# Altium project CANwheel.PrjPcb
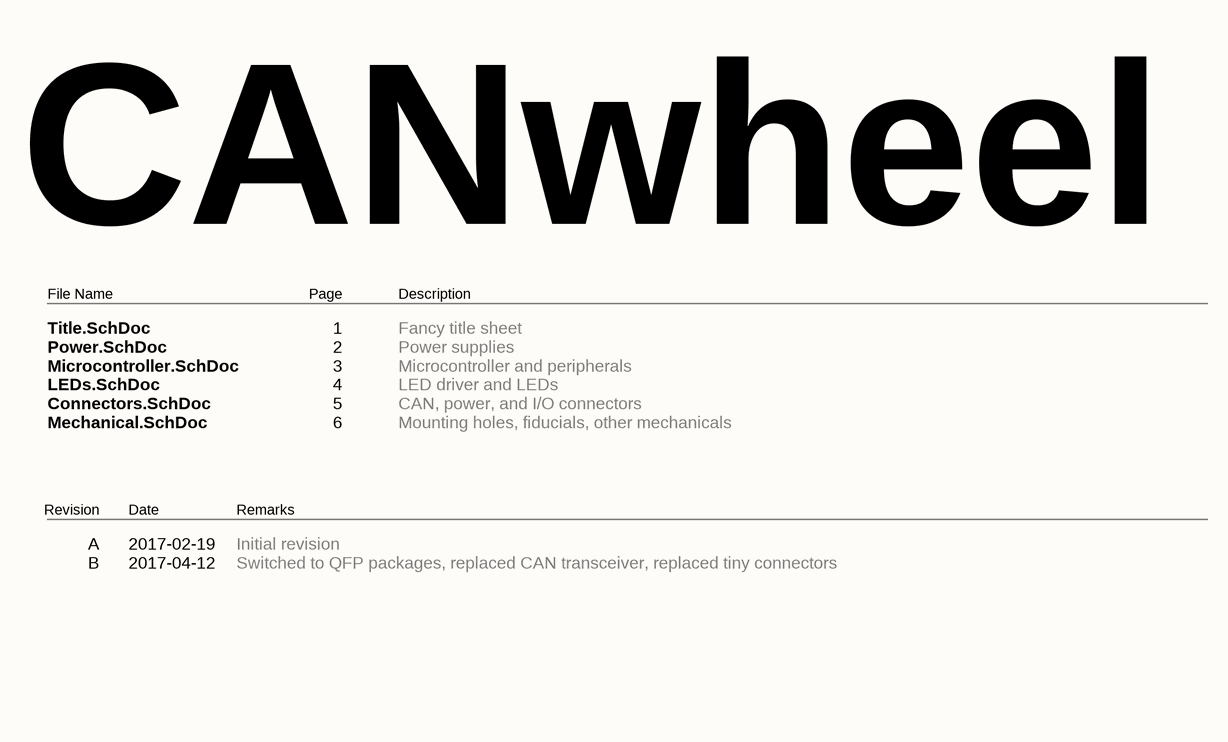
[diagram p0: Title.SchDoc]
ProjectRevision: B; ProjectCar: UV17
6 sheets, 59 parts. Net scope: global (net labels, ports and power ports of the same name join across sheets).
Board file: CANwheel.PcbDoc
Sheets:
  Title.SchDoc
  Power.SchDoc
  Microcontroller.SchDoc
  LEDs.SchDoc
  Connectors.SchDoc
  Mechanical.SchDoc

## Sheet Title.SchDoc: Title Page
size Letter; Date: 2017-02-19; Revision: A; SheetNumber: 1; SheetTotal: 6; ProjectTitle: CANwheel

### Notes on the sheet
- CANwheel
- File Name
- Page
- Description
- Title.SchDoc
  Power.SchDoc
  Microcontroller.SchDoc
  LEDs.SchDoc
  Connectors.SchDoc
  Mechanical.SchDoc
- 1
  2
  3
  4
  5
  6
- Fancy title sheet
  Power supplies
  Microcontroller and peripherals
  LED driver and LEDs
  CAN, power, and I/O connectors
  Mounting holes, fiducials, other mechanicals
- Revision
- Date
- Remarks
- A
  B
- 2017-02-19
  2017-04-12
- Initial revision
  Switched to QFP packages, replaced CAN transceiver, replaced tiny connectors
- Date:
- Revision:
- Sheet:
- /

## Sheet Power.SchDoc: Power Supplies
size Letter; Date: 2017-02-19; Revision: A; SheetNumber: 2; SheetTotal: 6; ProjectTitle: CANwheel
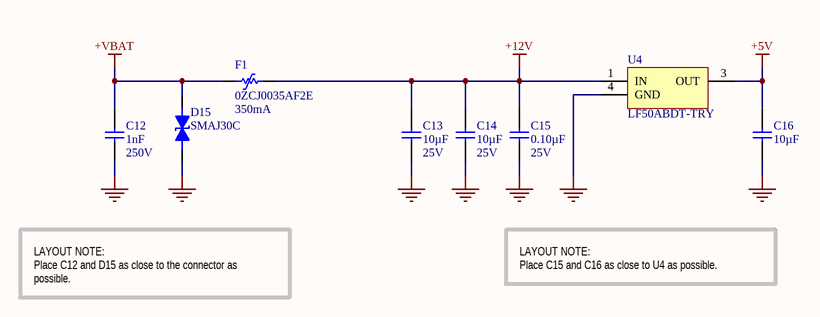
[diagram p1: Power.SchDoc]

### Parts
C12  value 1nF  Voltage: 250V  [CAP-0805-M]  (hidden comment: CAP 1nF ±10% 250V 0805 X7R)
C13  value 10µF  Voltage: 25V  [CAP-1206-M]  (hidden comment: CAP 10µF ±10% 25V 1206 X7R)
C14  value 10µF  Voltage: 25V  [CAP-1206-M]  (hidden comment: CAP 10µF ±10% 25V 1206 X7R)
C15  value 0.10µF  Voltage: 25V  [CAP-0402-M]  (hidden comment: CAP 0.10µF ±10% 25V 0402 X7R)
C16  value 10µF  [CAP-0805-M]  (hidden comment: CAP 10µF ±10% 6.3V 0805 X7R)
D15  SMAJ30C  [SON127P500X135-2N]
F1  0ZCJ0035AF2E  value 350mA  [0ZCJ-1206-0.9]
U4  LF50ABDT-TRY  [DPAK228P972X240-3N]

### Nets
+5V: C16.1 U4.3(OUT)
+12V: C13.2 C14.2 C15.2 F1.2 U4.1(IN)
+VBAT: C12.1 D15.1 F1.1
GND: C12.2 C13.1 C14.1 C15.1 C16.2 D15.2 U4.4(GND)

### Notes on the sheet
- LAYOUT NOTE:
  Place C12 and D15 as close to the connector as possible.
- LAYOUT NOTE:
  Place C15 and C16 as close to U4 as possible.
- Date:
- Revision:
- Sheet:
- /

### Library data of the parts
C12 = CC0805KRX7RYBB102: Manufacturer: Yageo; Manufacturer Series: CC; Part Number: CC0805KRX7RYBB102; Component Type: Standard; Tolerance: ±10%; Package: 0805; Temperature Coefficient: X7R; Temperature Range: -55°C ~ 125°C; Supplier 1: Digi-Key; Supplier Part Number 1: 311-1470-1-ND
C13 C14 = CC1206KKX7R8BB106: Manufacturer: Yageo; Manufacturer Series: CC; Part Number: CC1206KKX7R8BB106; Component Type: Standard; Tolerance: ±10%; Package: 1206; Temperature Coefficient: X7R; Temperature Range: -55°C ~ 125°C; Supplier 1: Digi-Key; Supplier Part Number 1: 311-1959-1-ND
C15 = CC0402KRX7R8BB104: Manufacturer: Yageo; Manufacturer Series: CC; Part Number: CC0402KRX7R8BB104; Component Type: Standard; Tolerance: ±10%; Package: 0402; Temperature Coefficient: X7R; Temperature Range: -55°C ~ 125°C; Supplier 1: Digi-Key; Supplier Part Number 1: 311-2077-1-ND
C16 = CC0805KKX7R5BB106: Manufacturer: Yageo; Manufacturer Series: CC; Part Number: CC0805KKX7R5BB106; Component Type: Standard; Tolerance: ±10%; Voltage: 6.3V; Package: 0805; Temperature Coefficient: X7R; Temperature Range: -55°C ~ 125°C; Supplier 1: Digi-Key; Supplier Part Number 1: 311-1877-1-ND
U4 = LF50ABDT-TRY: Supplier 1: Digi-Key; Supplier Part Number 1: 497-10199-1-ND

## Sheet Microcontroller.SchDoc: Microcontroller
size Letter; Date: 2017-02-19; Revision: A; SheetNumber: 3; SheetTotal: 6; ProjectTitle: CANwheel
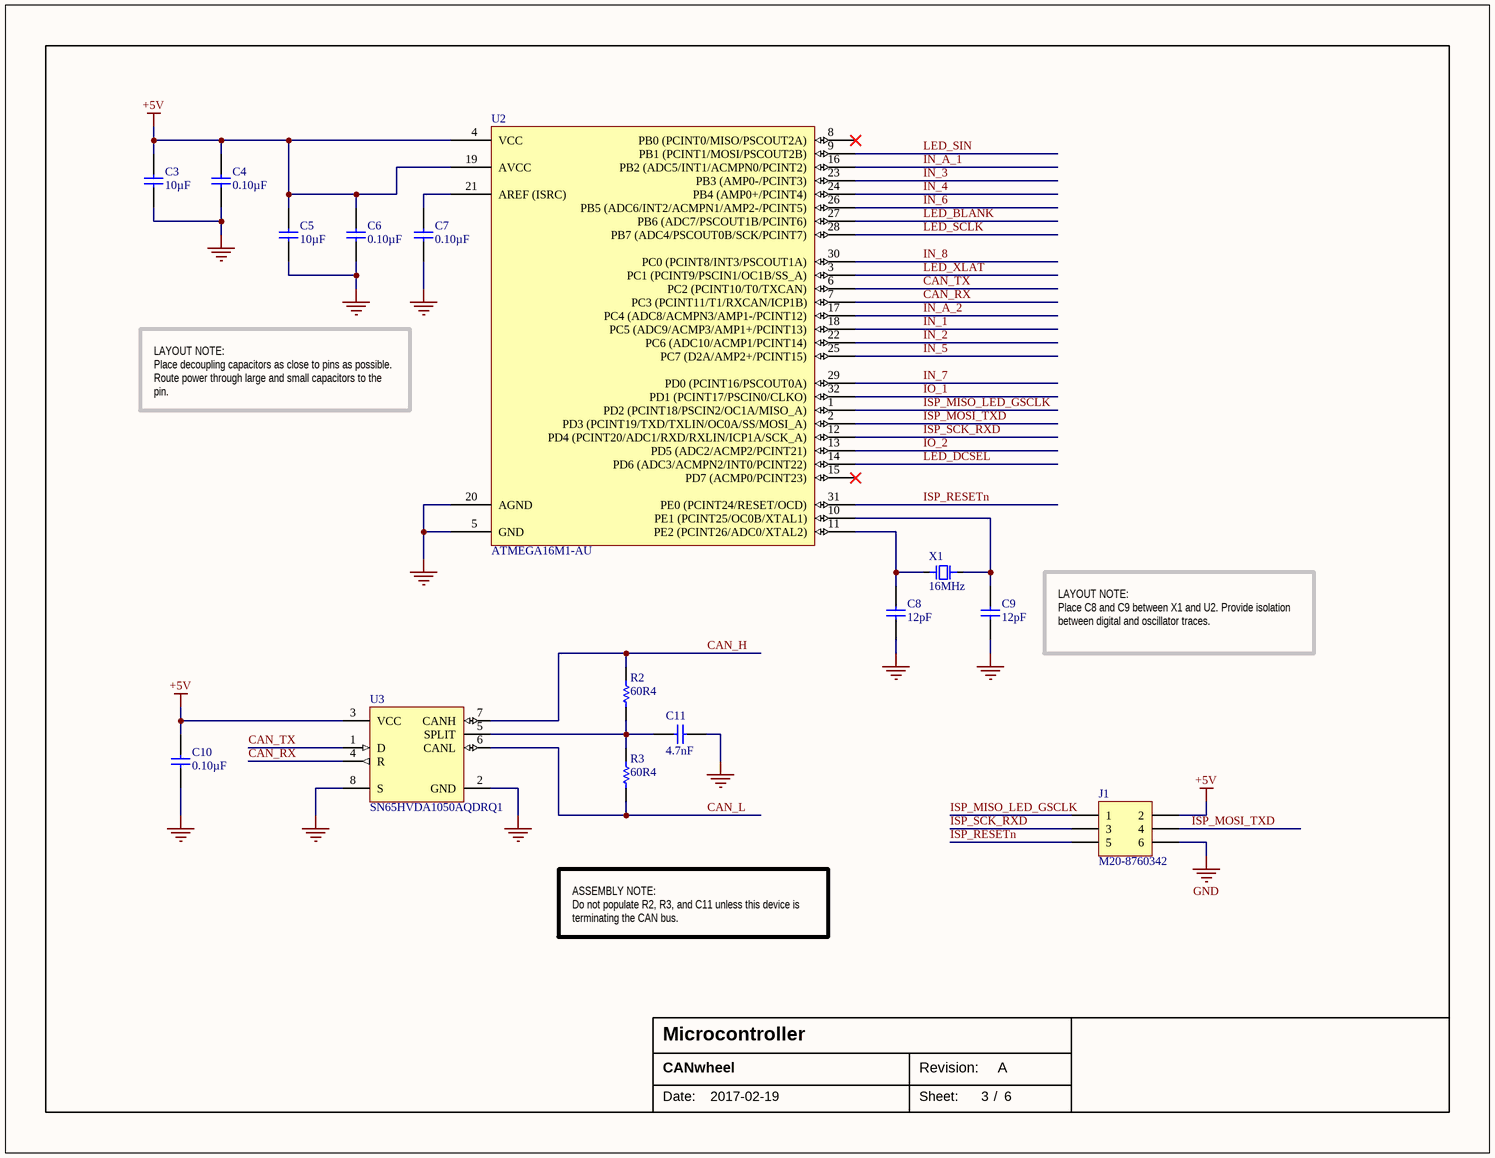
[diagram p2: Microcontroller.SchDoc]

### Parts
C3  value 10µF  [CAP-0805-M]  (hidden comment: CAP 10µF ±10% 6.3V 0805 X7R)
C4  value 0.10µF  [CAP-0402-M]  (hidden comment: CAP 0.10µF ±10% 6.3V 0402 X7R)
C5  value 10µF  [CAP-0805-M]  (hidden comment: CAP 10µF ±10% 6.3V 0805 X7R)
C6  value 0.10µF  [CAP-0402-M]  (hidden comment: CAP 0.10µF ±10% 6.3V 0402 X7R)
C7  value 0.10µF  [CAP-0402-M]  (hidden comment: CAP 0.10µF ±10% 6.3V 0402 X7R)
C8  value 12pF  [CAP-0402-M]  (hidden comment: CAP 12pF ±5% 50V 0402 C0G, NP0)
C9  value 12pF  [CAP-0402-M]  (hidden comment: CAP 12pF ±5% 50V 0402 C0G, NP0)
C10  value 0.10µF  [CAP-0402-M]  (hidden comment: CAP 0.10µF ±10% 6.3V 0402 X7R)
C11  value 4.7nF  [CAP-0402-M]  (hidden comment: CAP 4700pF ±10% 16V 0402 X7R)
J1  M20-8760342  [M20-8760342]
R2  value 60R4  [RES-0805-M]  (hidden comment: RES 60R4 1% 1/8 W 0805 ±100ppm/°C)
R3  value 60R4  [RES-0805-M]  (hidden comment: RES 60R4 1% 1/8 W 0805 ±100ppm/°C)
U2  ATMEGA16M1-AU  [TQFP80P900X900X120-32N]
U3  SN65HVDA1050AQDRQ1  [SOIC127P600X175-8M]
X1  value 16MHz  [SON127P500X135-2N]  (hidden comment: 7A-16.000MAAE-T)

### Nets
+5V: C3.1 C4.1 C5.1 C6.1 C10.1 J1.2 U2.4(VCC) U2.19(AVCC) U3.3(VCC)
GND: C3.2 C4.2 C5.2 C6.2 C7.2 C8.1 C9.1 C10.2 C11.1 J1.6 U2.5(GND) U2.20(AGND) U3.2(GND) U3.8(S)
CAN_H: R2.1 U3.7(CANH)
CAN_L: R3.1 U3.6(CANL)
CAN_RX: U2.7(PC3_(PCINT11/T1/RXCAN/ICP1B)) U3.4(R)
CAN_TX: U2.6(PC2_(PCINT10/T0/TXCAN)) U3.1(D)
IN_1: U2.18(PC5_(ADC9/ACMP3/AMP1+/PCINT13))
IN_2: U2.22(PC6_(ADC10/ACMP1/PCINT14))
IN_3: U2.23(PB3_(AMP0-/PCINT3))
IN_4: U2.24(PB4_(AMP0+/PCINT4))
IN_5: U2.25(PC7_(D2A/AMP2+/PCINT15))
IN_6: U2.26(PB5_(ADC6/INT2/ACMPN1/AMP2-/PCINT5))
IN_7: U2.29(PD0_(PCINT16/PSCOUT0A))
IN_8: U2.30(PC0_(PCINT8/INT3/PSCOUT1A))
IN_A_1: U2.16(PB2_(ADC5/INT1/ACMPN0/PCINT2))
IN_A_2: U2.17(PC4_(ADC8/ACMPN3/AMP1-/PCINT12))
IO_1: U2.32(PD1_(PCINT17/PSCIN0/CLKO))
IO_2: U2.13(PD5_(ADC2/ACMP2/PCINT21))
ISP_MISO_LED_GSCLK: J1.1 U2.1(PD2_(PCINT18/PSCIN2/OC1A/MISO_A))
ISP_MOSI_TXD: J1.4 U2.2(PD3_(PCINT19/TXD/TXLIN/OC0A/SS/MOSI_A))
ISP_RESETn: J1.5 U2.31(PE0_(PCINT24/RESET/OCD))
ISP_SCK_RXD: J1.3 U2.12(PD4_(PCINT20/ADC1/RXD/RXLIN/ICP1A/SCK_A))
LED_BLANK: U2.27(PB6_(ADC7/PSCOUT1B/PCINT6))
LED_DCSEL: U2.14(PD6_(ADC3/ACMPN2/INT0/PCINT22))
LED_SCLK: U2.28(PB7_(ADC4/PSCOUT0B/SCK/PCINT7))
LED_SIN: U2.9(PB1_(PCINT1/MOSI/PSCOUT2B))
LED_XLAT: U2.3(PC1_(PCINT9/PSCIN1/OC1B/SS_A))
NetC7_1: C7.1 U2.21(AREF_(ISRC))
NetC8_2: C8.2 U2.11(PE2_(PCINT26/ADC0/XTAL2)) X1.2
NetC9_2: C9.2 U2.10(PE1_(PCINT25/OC0B/XTAL1)) X1.1
NetC11_2: C11.2 R2.2 R3.2 U3.5(SPLIT)

Not connected (* = marked no-connect by the designer): U2 8(PB0_(PCINT0/MISO/PSCOUT2A))* 15(PD7_(ACMP0/PCINT23))*

### Notes on the sheet
- LAYOUT NOTE:
  Place decoupling capacitors as close to pins as possible. Route power through large and small capacitors to the pin.
- LAYOUT NOTE:
  Place C8 and C9 between X1 and U2. Provide isolation between digital and oscillator traces.
- ASSEMBLY NOTE:
  Do not populate R2, R3, and C11 unless this device is terminating the CAN bus.
- Date:
- Revision:
- Sheet:
- /

### Library data of the parts
C3 C5 = CC0805KKX7R5BB106: as C16 on sheet Power; Part Number: CC0805KKX7R5BB106; Component Type: Standard; Tolerance: ±10%; Voltage: 6.3V; Package: 0805; Temperature Coefficient: X7R; Temperature Range: -55°C ~ 125°C; Supplier 1: Digi-Key; Supplier Part Number 1: 311-1877-1-ND
C4 C6 C7 C10 = CC0402KRX7R5BB104: Manufacturer: Yageo; Manufacturer Series: CC; Part Number: CC0402KRX7R5BB104; Component Type: Standard; Tolerance: ±10%; Voltage: 6.3V; Package: 0402; Temperature Coefficient: X7R; Temperature Range: -55°C ~ 125°C; Supplier 1: Digi-Key; Supplier Part Number 1: 311-1701-1-ND
C8 C9 = CC0402JRNPO9BN120: Manufacturer: Yageo; Manufacturer Series: CC; Part Number: CC0402JRNPO9BN120; Component Type: Standard; Tolerance: ±5%; Voltage: 50V; Package: 0402; Temperature Coefficient: C0G, NP0; Temperature Range: -55°C ~ 125°C; Supplier 1: Digi-Key; Supplier Part Number 1: 311-1016-1-ND
C11 = CC0402KRX7R7BB472: Manufacturer: Yageo; Manufacturer Series: CC; Part Number: CC0402KRX7R7BB472; Component Type: Standard; Tolerance: ±10%; Voltage: 16V; Package: 0402; Temperature Coefficient: X7R; Temperature Range: -55°C ~ 125°C; Supplier 1: Digi-Key; Supplier Part Number 1: 311-1709-1-ND
R2 R3 = RC0805FR-0760R4L: Manufacturer: Yageo; Manufacturer Series: RC; Power: 1/8 W; Part Number: RC0805FR-0760R4L; Component Type: Standard; Tolerance: 1%; Package: 0805; Temperature Coefficient: ±100ppm/°C; Temperature Range: -55°C ~ 155°C; Supplier 1: Digi-Key; Supplier Part Number 1: 311-60.4CRCT-ND
U2 = ATMEGA16M1-AU: ATmega16M1 32-QFP 7x7 mm
U3 = SN65HVDA1050AQDRQ1: CAN transceiver; Supplier 1: Digi-Key; Supplier Part Number 1: 296-25836-1-ND
X1 = 7A-16.000MAAE-T: SMD Crystal Oscillator 12 pF; Load Capacitance: 12pF; Supplier 1: Digi-Key; Supplier Part Number 1: 887-1747-1-ND

## Sheet LEDs.SchDoc: LED Driver and LEDs
size Letter; Date: 2017-02-19; Revision: A; SheetNumber: 4; SheetTotal: 6; ProjectTitle: CANwheel
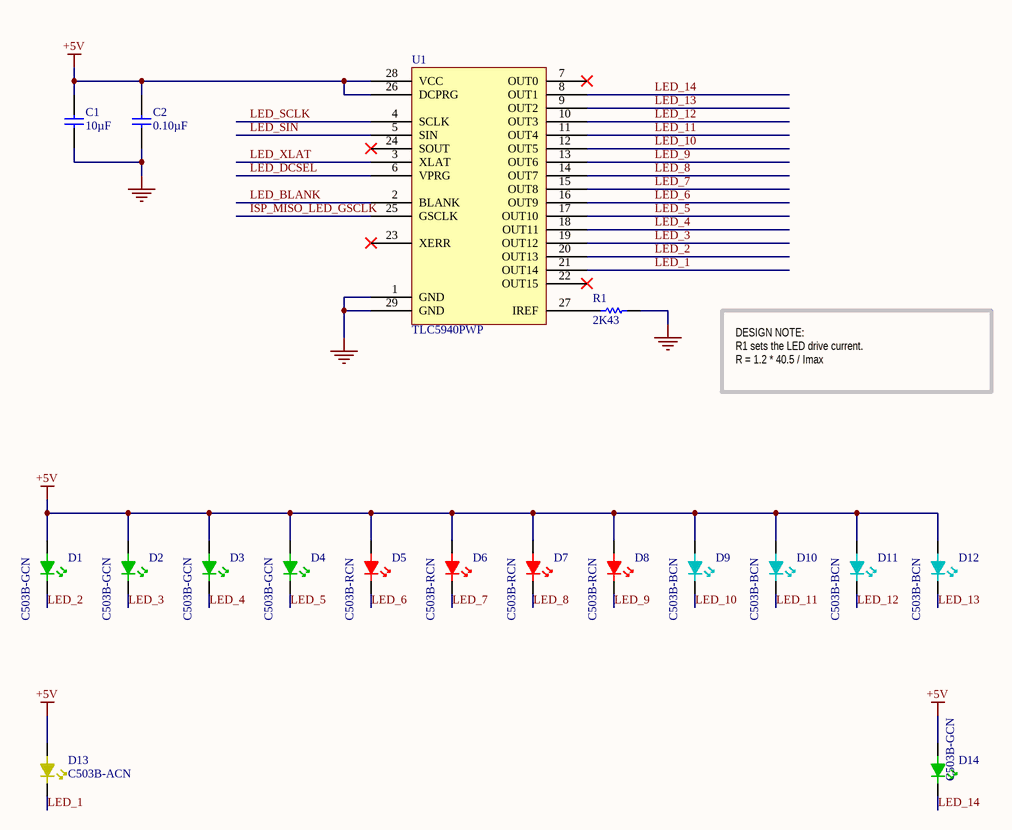
[diagram p3: LEDs.SchDoc]

### Parts
C1  value 10µF  [CAP-0805-M]  (hidden comment: CAP 10µF ±10% 6.3V 0805 X7R)
C2  value 0.10µF  [CAP-0402-M]  (hidden comment: CAP 0.10µF ±10% 6.3V 0402 X7R)
D1  C503B-GCN  [LED-5mm-G]
D2  C503B-GCN  [LED-5mm-G]
D3  C503B-GCN  [LED-5mm-G]
D4  C503B-GCN  [LED-5mm-G]
D5  C503B-RCN  [LED-5mm-R]
D6  C503B-RCN  [LED-5mm-R]
D7  C503B-RCN  [LED-5mm-R]
D8  C503B-RCN  [LED-5mm-R]
D9  C503B-BCN  [LED-5mm-B]
D10  C503B-BCN  [LED-5mm-B]
D11  C503B-BCN  [LED-5mm-B]
D12  C503B-BCN  [LED-5mm-B]
D13  C503B-ACN  [LED-5mm-A]
D14  C503B-GCN  [LED-5mm-G]
R1  value 2K43  [RES-0603-M]  (hidden comment: RES 2K43 1% 1/10 W 0603 ±100ppm/°C)
U1  TLC5940PWP  [TSOP65P640X120_HS-29N]

### Nets
+5V: C1.1 C2.1 D1.1 D2.1 D3.1 D4.1 D5.1 D6.1 D7.1 D8.1 D9.1 D10.1 D11.1 D12.1 D13.1 D14.1 U1.26(DCPRG) U1.28(VCC)
GND: C1.2 C2.2 R1.1 U1.1(GND) U1.29(GND)
ISP_MISO_LED_GSCLK: U1.25(GSCLK)
LED_1: D13.2 U1.21(OUT14)
LED_2: D1.2 U1.20(OUT13)
LED_3: D2.2 U1.19(OUT12)
LED_4: D3.2 U1.18(OUT11)
LED_5: D4.2 U1.17(OUT10)
LED_6: D5.2 U1.16(OUT9)
LED_7: D6.2 U1.15(OUT8)
LED_8: D7.2 U1.14(OUT7)
LED_9: D8.2 U1.13(OUT6)
LED_10: D9.2 U1.12(OUT5)
LED_11: D10.2 U1.11(OUT4)
LED_12: D11.2 U1.10(OUT3)
LED_13: D12.2 U1.9(OUT2)
LED_14: D14.2 U1.8(OUT1)
LED_BLANK: U1.2(BLANK)
LED_DCSEL: U1.6(VPRG)
LED_SCLK: U1.4(SCLK)
LED_SIN: U1.5(SIN)
LED_XLAT: U1.3(XLAT)
NetR1_2: R1.2 U1.27(IREF)

Not connected (* = marked no-connect by the designer): U1 7(OUT0)* 22(OUT15)* 23(XERR)* 24(SOUT)*

### Notes on the sheet
- DESIGN NOTE:
  R1 sets the LED drive current.
  R = 1.2 * 40.5 / Imax
- Date:
- Revision:
- Sheet:
- /

### Library data of the parts
C1 = CC0805KKX7R5BB106: as C16 on sheet Power; Part Number: CC0805KKX7R5BB106; Component Type: Standard; Tolerance: ±10%; Voltage: 6.3V; Package: 0805; Temperature Coefficient: X7R; Temperature Range: -55°C ~ 125°C; Supplier 1: Digi-Key; Supplier Part Number 1: 311-1877-1-ND
C2 = CC0402KRX7R5BB104: as C4 on sheet Microcontroller; Part Number: CC0402KRX7R5BB104; Component Type: Standard; Tolerance: ±10%; Voltage: 6.3V; Package: 0402; Temperature Coefficient: X7R; Temperature Range: -55°C ~ 125°C; Supplier 1: Digi-Key; Supplier Part Number 1: 311-1701-1-ND
R1 = RC0603FR-072K43L: Manufacturer: Yageo; Manufacturer Series: RC; Power: 1/10 W; Part Number: RC0603FR-072K43L; Component Type: Standard; Tolerance: 1%; Package: 0603; Temperature Coefficient: ±100ppm/°C; Temperature Range: -55°C ~ 155°C; Supplier 1: Digi-Key; Supplier Part Number 1: 311-2.43KHRCT-ND

## Sheet Connectors.SchDoc: Connectors
size Letter; Date: 2017-02-19; Revision: A; SheetNumber: 5; SheetTotal: 6; ProjectTitle: CANwheel
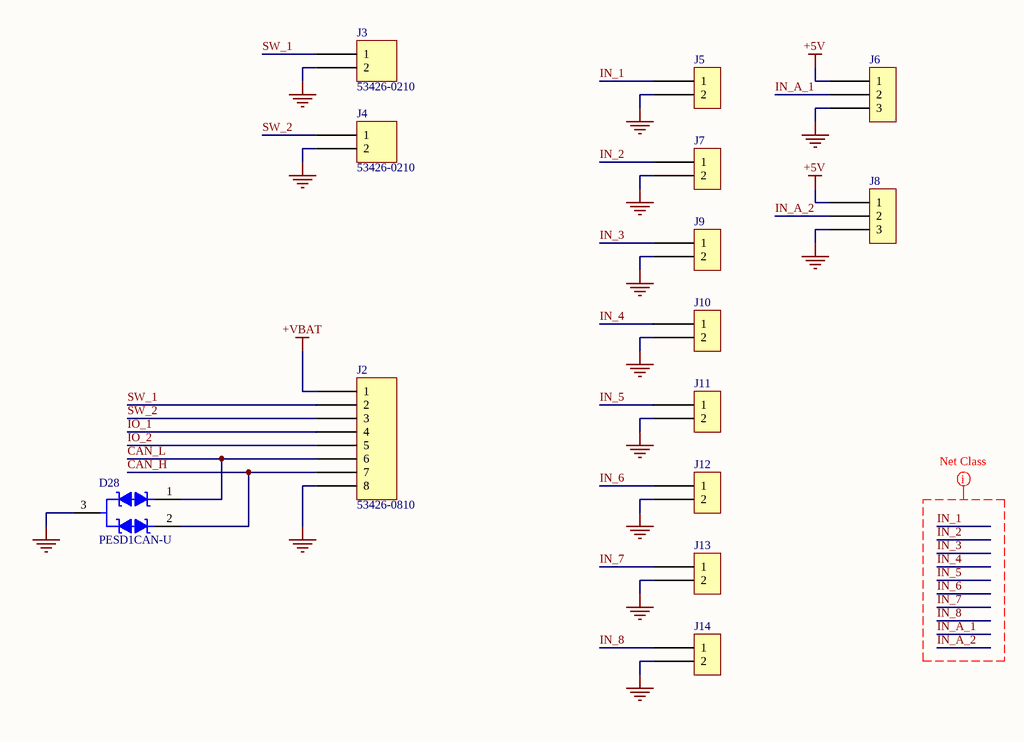
[diagram p4: Connectors.SchDoc]

### Parts
D28  PESD1CAN-U  [SOT65P210X110-3N]
J2  53426-0810  [53426-0810]
J3  53426-0210  [53426-0210]
J4  53426-0210  [53426-0210]
J5  Wire-2-0.7mm  [WIRE-2-0.7mm]  (value not drawn)
J6  Wire-3-0.7mm  [WIRE-3-0.7mm]  (value not drawn)
J7  Wire-2-0.7mm  [WIRE-2-0.7mm]  (value not drawn)
J8  Wire-3-0.7mm  [WIRE-3-0.7mm]  (value not drawn)
J9  Wire-2-0.7mm  [WIRE-2-0.7mm]  (value not drawn)
J10  Wire-2-0.7mm  [WIRE-2-0.7mm]  (value not drawn)
J11  Wire-2-0.7mm  [WIRE-2-0.7mm]  (value not drawn)
J12  Wire-2-0.7mm  [WIRE-2-0.7mm]  (value not drawn)
J13  Wire-2-0.7mm  [WIRE-2-0.7mm]  (value not drawn)
J14  Wire-2-0.7mm  [WIRE-2-0.7mm]  (value not drawn)

### Nets
+5V: J6.1 J8.1
+VBAT: J2.1
GND: D28.3 J2.8 J3.2 J4.2 J5.2 J6.3 J7.2 J8.3 J9.2 J10.2 J11.2 J12.2 J13.2 J14.2
CAN_H: D28.2 J2.7
CAN_L: D28.1 J2.6
IN_1: J5.1
IN_2: J7.1
IN_3: J9.1
IN_4: J10.1
IN_5: J11.1
IN_6: J12.1
IN_7: J13.1
IN_8: J14.1
IN_A_1: J6.2
IN_A_2: J8.2
IO_1: J2.4
IO_2: J2.5
SW_1: J2.2 J3.1
SW_2: J2.3 J4.1

### Layout directives
net class INPUT: IN_1, IN_2, IN_3, IN_4, IN_5, IN_6, IN_7, IN_8, IN_A_1, IN_A_2

### Notes on the sheet
- Date:
- Revision:
- Sheet:
- /

### Library data of the parts
J2 = 53426-0810: Molex Mini-Lock™ 53426
J3 J4 = 53426-0210: Molex Mini-Lock™ 53426

## Sheet Mechanical.SchDoc: Mechanical
size Letter; Date: 2017-02-19; Revision: A; SheetNumber: 6; SheetTotal: 6; ProjectTitle: CANwheel
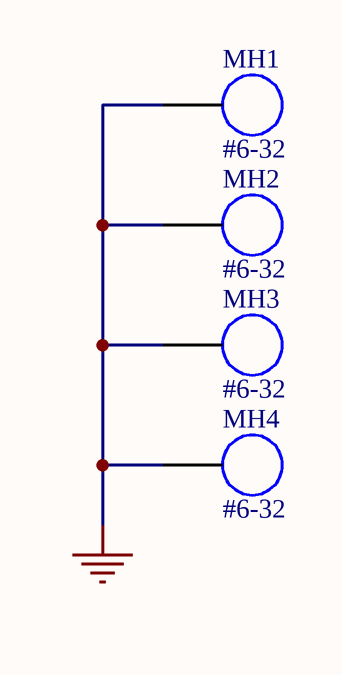
[diagram p5: Mechanical.SchDoc]

### Parts
MH1  #6-32  [MH-6-32]
MH2  #6-32  [MH-6-32]
MH3  #6-32  [MH-6-32]
MH4  #6-32  [MH-6-32]

### Nets
GND: MH1.1 MH2.1 MH3.1 MH4.1

### Notes on the sheet
- Date:
- Revision:
- Sheet:
- /

### Library data of the parts
MH1-MH4 = #6-32 Mounting Hole

## Nets that join several sheets
+5V: Power (C16.1 U4.3), Microcontroller (9 pins), LEDs (18 pins), Connectors (J6.1 J8.1)
+VBAT: Power (C12.1 D15.1 F1.1), Connectors (J2.1)
GND: Power (7 pins), Microcontroller (14 pins), LEDs (5 pins), Connectors (14 pins), Mechanical (MH1.1 MH2.1 MH3.1 MH4.1)
CAN_H: Microcontroller (R2.1 U3.7), Connectors (D28.2 J2.7)
CAN_L: Microcontroller (R3.1 U3.6), Connectors (D28.1 J2.6)
IN_1: Microcontroller (U2.18), Connectors (J5.1)
IN_2: Microcontroller (U2.22), Connectors (J7.1)
IN_3: Microcontroller (U2.23), Connectors (J9.1)
IN_4: Microcontroller (U2.24), Connectors (J10.1)
IN_5: Microcontroller (U2.25), Connectors (J11.1)
IN_6: Microcontroller (U2.26), Connectors (J12.1)
IN_7: Microcontroller (U2.29), Connectors (J13.1)
IN_8: Microcontroller (U2.30), Connectors (J14.1)
IN_A_1: Microcontroller (U2.16), Connectors (J6.2)
IN_A_2: Microcontroller (U2.17), Connectors (J8.2)
IO_1: Microcontroller (U2.32), Connectors (J2.4)
IO_2: Microcontroller (U2.13), Connectors (J2.5)
ISP_MISO_LED_GSCLK: Microcontroller (J1.1 U2.1), LEDs (U1.25)
LED_BLANK: Microcontroller (U2.27), LEDs (U1.2)
LED_DCSEL: Microcontroller (U2.14), LEDs (U1.6)
LED_SCLK: Microcontroller (U2.28), LEDs (U1.4)
LED_SIN: Microcontroller (U2.9), LEDs (U1.5)
LED_XLAT: Microcontroller (U2.3), LEDs (U1.3)